# Altium schematic sheet inverter-schem.SchDoc
size 381 x 241 mm; SheetNumber: 1; SheetTotal: 1
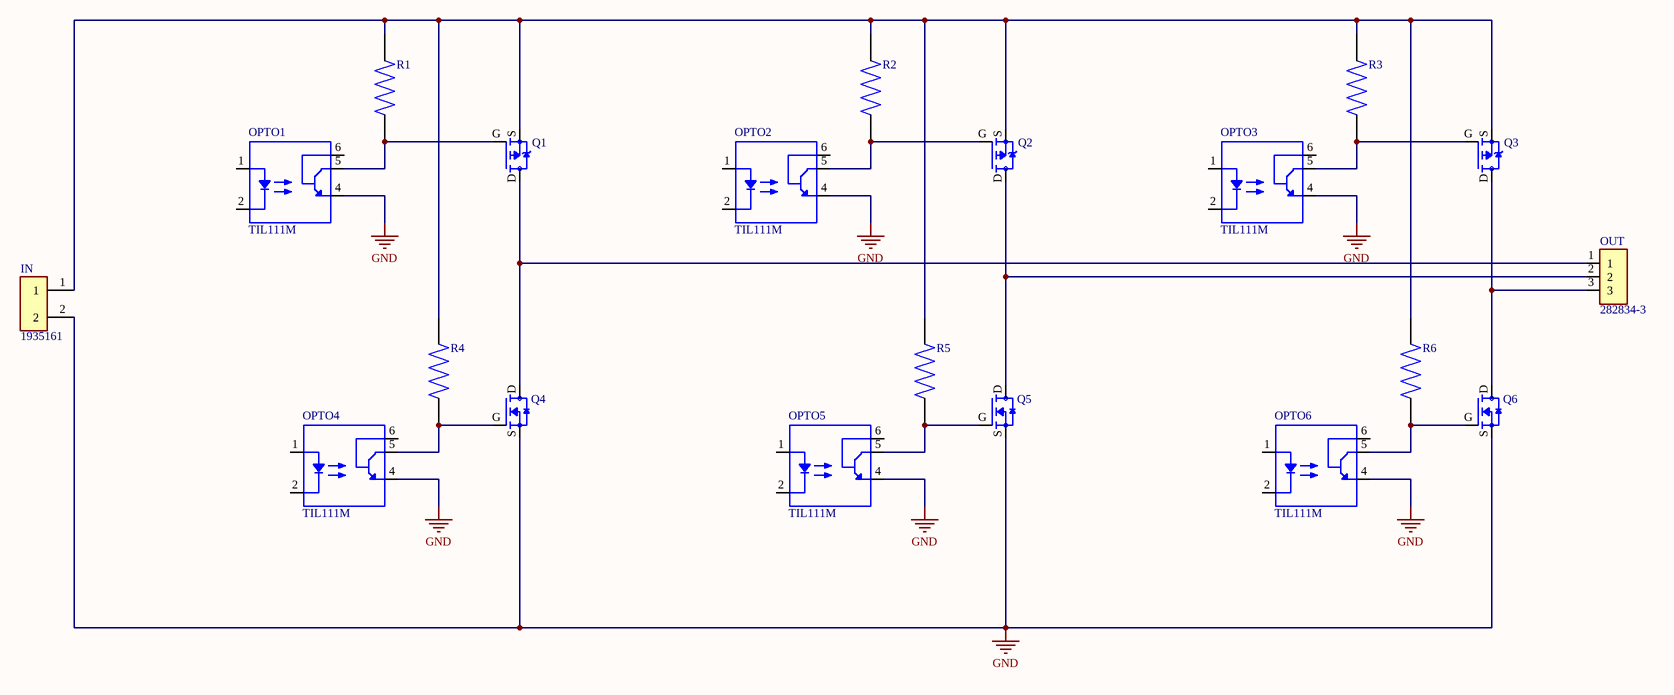
[diagram p0: inverter-schem.SchDoc]

## Parts
IN  1935161  [PHOENIX_1935161]
OPTO1  TIL111M  [DIP1016W50P254L742H480Q6]
OPTO2  TIL111M  [DIP1016W50P254L742H480Q6]
OPTO3  TIL111M  [DIP1016W50P254L742H480Q6]
OPTO4  TIL111M  [DIP1016W50P254L742H480Q6]
OPTO5  TIL111M  [DIP1016W50P254L742H480Q6]
OPTO6  TIL111M  [DIP1016W50P254L742H480Q6]
OUT  282834-3  [TE_282834-3]
Q1  IRF9540NSTRLPBF  [DPAK254P1524X483-4_3N]  (value not drawn)  (mechanical)
Q2  IRF9540NSTRLPBF  [DPAK254P1524X483-4_3N]  (value not drawn)  (mechanical)
Q3  IRF9540NSTRLPBF  [DPAK254P1524X483-4_3N]  (value not drawn)  (mechanical)
Q4  AOD4184A  [DPAK228P994X240-4N]  (value not drawn)
Q5  AOD4184A  [DPAK228P994X240-4N]  (value not drawn)
Q6  AOD4184A  [DPAK228P994X240-4N]  (value not drawn)
R1  RNCP1206FTD10K0  [RESC3115X60N]  (value not drawn)
R2  RNCP1206FTD10K0  [RESC3115X60N]  (value not drawn)
R3  RNCP1206FTD10K0  [RESC3115X60N]  (value not drawn)
R4  RNCP1206FTD10K0  [RESC3115X60N]  (value not drawn)
R5  RNCP1206FTD10K0  [RESC3115X60N]  (value not drawn)
R6  RNCP1206FTD10K0  [RESC3115X60N]  (value not drawn)

## Nets
GND: IN.2 OPTO1.4(EM) OPTO2.4(EM) OPTO3.4(EM) OPTO4.4(EM) OPTO5.4(EM) OPTO6.4(EM) Q4.S Q5.S Q6.S
NetIN_1: IN.1 Q1.S Q2.S Q3.S R1.2 R2.2 R3.2 R4.2 R5.2 R6.2
NetOPTO1_5: OPTO1.5(CO) Q1.G R1.1
NetOPTO2_5: OPTO2.5(CO) Q2.G R2.1
NetOPTO3_5: OPTO3.5(CO) Q3.G R3.1
NetOPTO4_5: OPTO4.5(CO) Q4.G R4.1
NetOPTO5_5: OPTO5.5(CO) Q5.G R5.1
NetOPTO6_5: OPTO6.5(CO) Q6.G R6.1
NetOUT_1: OUT.1 Q1.D Q4.D
NetOUT_2: OUT.2 Q2.D Q5.D
NetOUT_3: OUT.3 Q3.D Q6.D

Not connected (* = marked no-connect by the designer): OPTO1 1(A) 2(C) 6(B); OPTO2 1(A) 2(C) 6(B); OPTO3 1(A) 2(C) 6(B); OPTO4 1(A) 2(C) 6(B); OPTO5 1(A) 2(C) 6(B); OPTO6 1(A) 2(C) 6(B)

## Library data of the parts
IN = 1935161: 2 Position Wire to Board Terminal Block Horizontal with Board 0.197 _5.00mm_ Through Hole; MF: Phoenix Contact; SnapEDA_Link: https://www.snapeda.com/parts/1935161/Phoenix%20Contact/view-part/423515/?ref=snap; MP: 1935161; Value: *; Digi-Key_Purchase_URL: https://www.digikey.ca/product-detail/en/phoenix-contact/1935161/277-1667-ND/568614?utm_source=snapeda&utm_medium=aggregator&utm_campaign=symbol; Digi-Key_Part_Number: 277-1667-ND; Package: None
OPTO1-OPTO6 = TIL111M: Optocoupler DC Input 1 Channel Trans W/Base DC Output 6-Pin Plastic Dip White; MF: Everlight Electronics; SnapEDA_Link: https://www.snapeda.com/parts/TIL111M/Everlight%20Electronics%20Co%20Ltd/view-part/448399/?ref=snap; Availability: Unavailable; Package: DIP-6 Fairchild Semiconductor; Price: None; MP: TIL111M; Value: *
OUT = 282834-3: 3 Position Wire to Board Terminal Block Horizontal with Board 0.100 (2.54mm); MF: TE Connectivity; EU_RoHS_Compliance: Compliant with Exemptions; SnapEDA_Link: https://www.snapeda.com/parts/282834-3/TE%20Connectivity%20AMP%20Connectors/view-part/398089/?ref=snap; Price: None; Check_prices: https://www.snapeda.com/parts/282834-3/TE%20Connectivity%20AMP%20Connectors/view-part/398089/?ref=eda; Purchase-URL: https://pricing.snapeda.com/search/part/282834-3/?ref=eda; Package: None; MP: 282834-3; Value: *; Availability: Good
Q1-Q3 = IRF9540NSTRLPBF: RoHS Compliant | Low RDS_on_ | Industry-leading quality | Dynamic dv/dt Rating | Fast Switching | Fully Avalanche Rated | 175C Operating Temperature | P-Channel MOSFET; MF: Infineon; Availability: Unavailable; SnapEDA_Link: https://www.snapeda.com/parts/IRF9540NSTRLPBF/Infineon%20Technologies/view-part/565416/?ref=snap; MP: IRF9540NSTRLPBF; Price: None; Value: *; Package: D2PAK Infineon
Q4-Q6 = AOD4184A: N-Channel 40V 13A _Ta_, 50A _Tc_ 2.3W _Ta_, 50W _Tc_ Surface Mount TO-252, _D-Pak_; MF: Alpha &; Price: None; Availability: Unavailable; Package: TO-252 Alpha &amp; Omega Semiconductor; MP: AOD4184A; Value: *; SnapEDA_Link: https://www.snapeda.com/parts/AOD4184A/Alpha%20%26%20Omega%20Semiconductor%20Inc./view-part/1746925/?ref=snap
R1-R6 = RNCP1206FTD10K0: RES 10K OHM 1% 1/2W 1206; MF: Stackpole Electronics; Price: None; Package: 1206 Stackpole Electronics Inc.; SnapEDA_Link: https://www.snapeda.com/parts/RNCP1206FTD10K0/Stackpole%20Electronics%20Inc/view-part/3210126/?ref=snap; DigiKey-Purchase-URL: https://snapeda.com/shop?store=DigiKey&id=3210126; Value: *; MP: RNCP1206FTD10K0; Availability: Unavailable